# Altium schematic sheet PES_BOARD_V2023.SchDoc: Overview
size A4; SheetNumber: 1; SheetTotal: 10
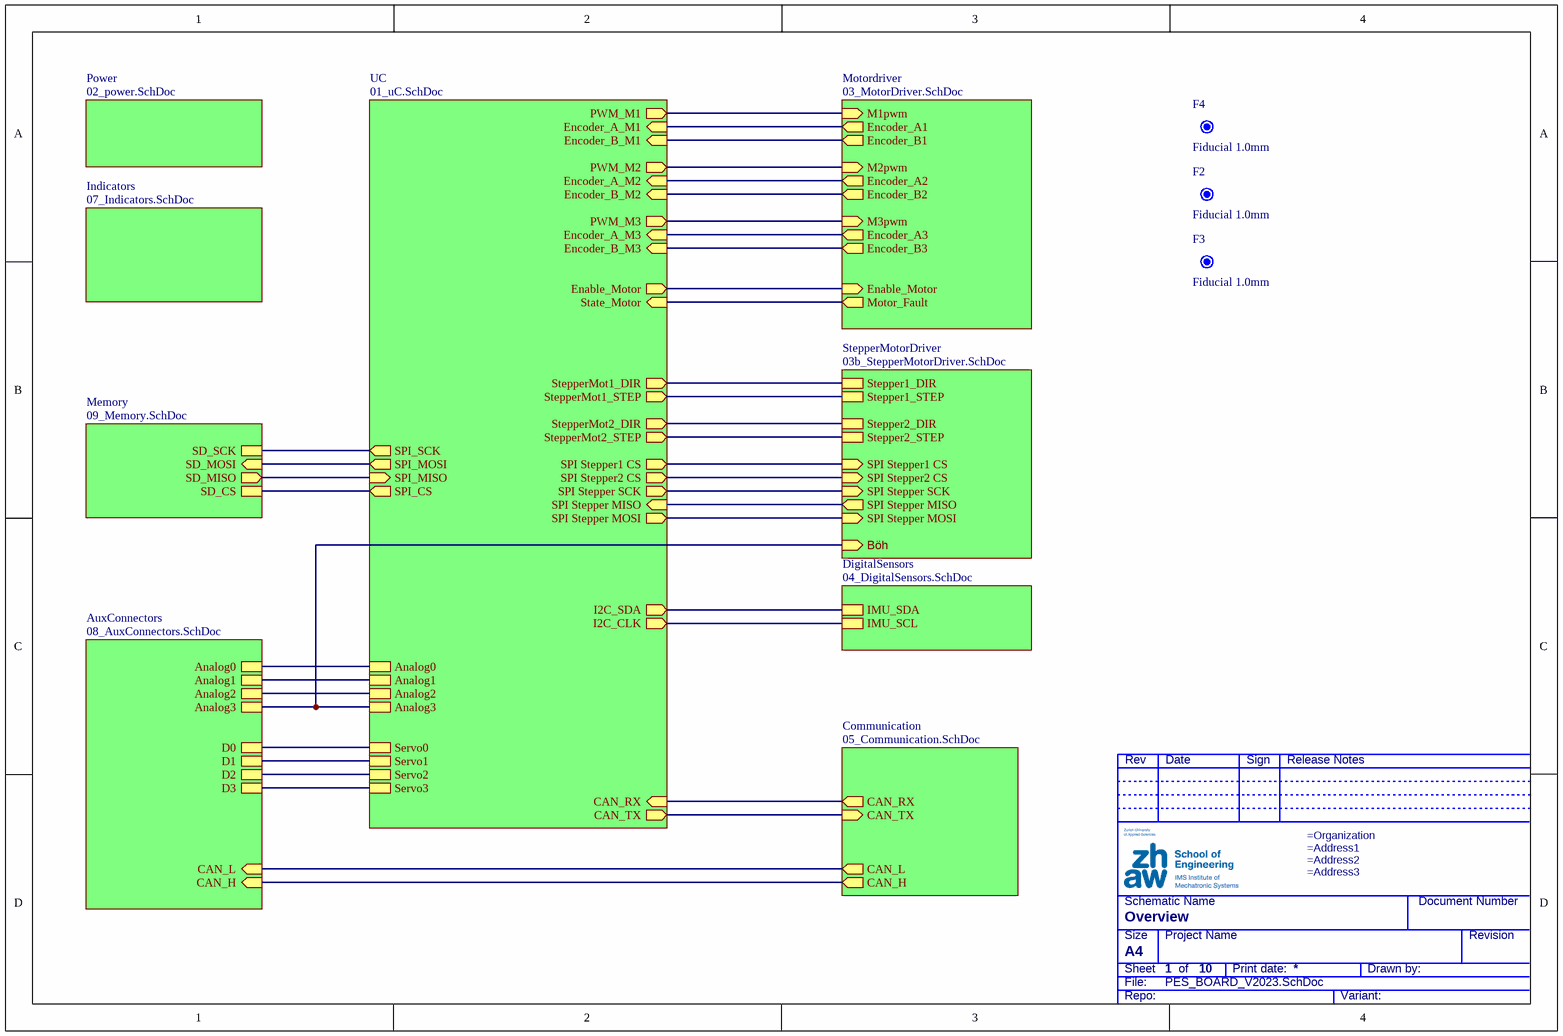
[diagram p0: PES_BOARD_V2023.SchDoc]

## Parts
F2  Fiducial 1.0mm  [FID1X2R]  (no BOM)
F3  Fiducial 1.0mm  [FID1X2R]  (no BOM)
F4  Fiducial 1.0mm  [FID1X2R]  (no BOM)

## Sub-sheets
AuxConnectors = 08_AuxConnectors.SchDoc: Analog1, D2, D3, Analog2, Analog3, D1, Analog0, D0, CAN_H (in), CAN_L (in)
Communication = 05_Communication.SchDoc: CAN_RX (out), CAN_TX (in), CAN_L (out), CAN_H (out)
DigitalSensors = 04_DigitalSensors.SchDoc: IMU_SDA, IMU_SCL
Indicators = 07_Indicators.SchDoc: no entries
Memory = 09_Memory.SchDoc: SD_CS, SD_SCK, SD_MISO (out), SD_MOSI (in)
Motordriver = 03_MotorDriver.SchDoc: Motor_Fault (out), Enable_Motor (in), Encoder_A1 (out), Encoder_B1 (out), Encoder_B2 (out), Encoder_A2 (out), M3pwm (in), Encoder_B3 (out), Encoder_A3 (out), M1pwm (in), M2pwm (in)
Power = 02_power.SchDoc: no entries
StepperMotorDriver = 03b_StepperMotorDriver.SchDoc: Stepper2_DIR, Stepper2_STEP, Stepper1_DIR, Stepper1_STEP, SPI Stepper MISO (out), SPI Stepper MOSI (in), SPI Stepper SCK (in), SPI Stepper2 CS (in), SPI Stepper1 CS (in), Böh (in)
UC = 01_uC.SchDoc: SPI_MOSI (out), SPI_SCK (out), SPI_MISO (in), CAN_TX (out), CAN_RX (in), Encoder_A_M1 (in), Encoder_B_M1 (in), Encoder_A_M2 (in), Encoder_B_M2 (in), PWM_M1 (out), PWM_M2 (out), Enable_Motor (out), State_Motor (in), Analog1, Analog0, Servo2, Analog3, Servo1, Servo0, Analog2, Servo3, Encoder_A_M3 (in), Encoder_B_M3 (in), PWM_M3 (out), I2C_SDA (out), StepperMot1_DIR (out), I2C_CLK (out), StepperMot1_STEP (out), SPI_CS (out), StepperMot2_STEP (out), StepperMot2_DIR (out), SPI Stepper2 CS (out), SPI Stepper SCK (out), SPI Stepper1 CS (out), SPI Stepper MISO (in), SPI Stepper MOSI (out)

## Nets
(unnamed): sheet UC/SPI_MOSI, sheet Memory/SD_MOSI
(unnamed): sheet UC/SPI_SCK, sheet Memory/SD_SCK
(unnamed): sheet UC/SPI_MISO, sheet Memory/SD_MISO
(unnamed): sheet UC/CAN_TX, sheet Communication/CAN_TX
(unnamed): sheet UC/CAN_RX, sheet Communication/CAN_RX
(unnamed): sheet UC/Encoder_A_M1, sheet Motordriver/Encoder_A1
(unnamed): sheet UC/Encoder_B_M1, sheet Motordriver/Encoder_B1
(unnamed): sheet UC/Encoder_A_M2, sheet Motordriver/Encoder_A2
(unnamed): sheet UC/Encoder_B_M2, sheet Motordriver/Encoder_B2
(unnamed): sheet UC/PWM_M1, sheet Motordriver/M1pwm
(unnamed): sheet UC/PWM_M2, sheet Motordriver/M2pwm
(unnamed): sheet UC/Enable_Motor, sheet Motordriver/Enable_Motor
(unnamed): sheet UC/State_Motor, sheet Motordriver/Motor_Fault
(unnamed): sheet UC/Analog1, sheet AuxConnectors/Analog1
(unnamed): sheet UC/Analog0, sheet AuxConnectors/Analog0
(unnamed): sheet UC/Servo2, sheet AuxConnectors/D2
(unnamed): sheet UC/Analog3, sheet AuxConnectors/Analog3, sheet StepperMotorDriver/Böh
(unnamed): sheet UC/Servo1, sheet AuxConnectors/D1
(unnamed): sheet UC/Servo0, sheet AuxConnectors/D0
(unnamed): sheet UC/Analog2, sheet AuxConnectors/Analog2
(unnamed): sheet UC/Servo3, sheet AuxConnectors/D3
(unnamed): sheet UC/Encoder_A_M3, sheet Motordriver/Encoder_A3
(unnamed): sheet UC/Encoder_B_M3, sheet Motordriver/Encoder_B3
(unnamed): sheet UC/PWM_M3, sheet Motordriver/M3pwm
(unnamed): sheet UC/I2C_SDA, sheet DigitalSensors/IMU_SDA
(unnamed): sheet UC/StepperMot1_DIR, sheet StepperMotorDriver/Stepper1_DIR
(unnamed): sheet UC/I2C_CLK, sheet DigitalSensors/IMU_SCL
(unnamed): sheet UC/StepperMot1_STEP, sheet StepperMotorDriver/Stepper1_STEP
(unnamed): sheet UC/SPI_CS, sheet Memory/SD_CS
(unnamed): sheet UC/StepperMot2_STEP, sheet StepperMotorDriver/Stepper2_STEP
(unnamed): sheet UC/StepperMot2_DIR, sheet StepperMotorDriver/Stepper2_DIR
(unnamed): sheet UC/SPI Stepper2 CS, sheet StepperMotorDriver/SPI Stepper2 CS
(unnamed): sheet UC/SPI Stepper SCK, sheet StepperMotorDriver/SPI Stepper SCK
(unnamed): sheet UC/SPI Stepper1 CS, sheet StepperMotorDriver/SPI Stepper1 CS
(unnamed): sheet UC/SPI Stepper MISO, sheet StepperMotorDriver/SPI Stepper MISO
(unnamed): sheet UC/SPI Stepper MOSI, sheet StepperMotorDriver/SPI Stepper MOSI
(unnamed): sheet Communication/CAN_L, sheet AuxConnectors/CAN_L
(unnamed): sheet Communication/CAN_H, sheet AuxConnectors/CAN_H

## Notes on the sheet
- Rev
- Date
- Sign
- Release Notes
- Schematic Name
- Document Number
- File:
- Sheet
- Size
- A4
- Project Name
- of
- Print date:
- Drawn by:
- Revision
- Repo:
- Variant:

## Library data of the parts
F2-F4 = CMP-00028-00005-17: Fiducial, SMD, d1.0; Type: Fiducial; Mounting Technology: SMD; Size: d1.0